# EAGLE board Test Machines (EAGLE 9.6.2)
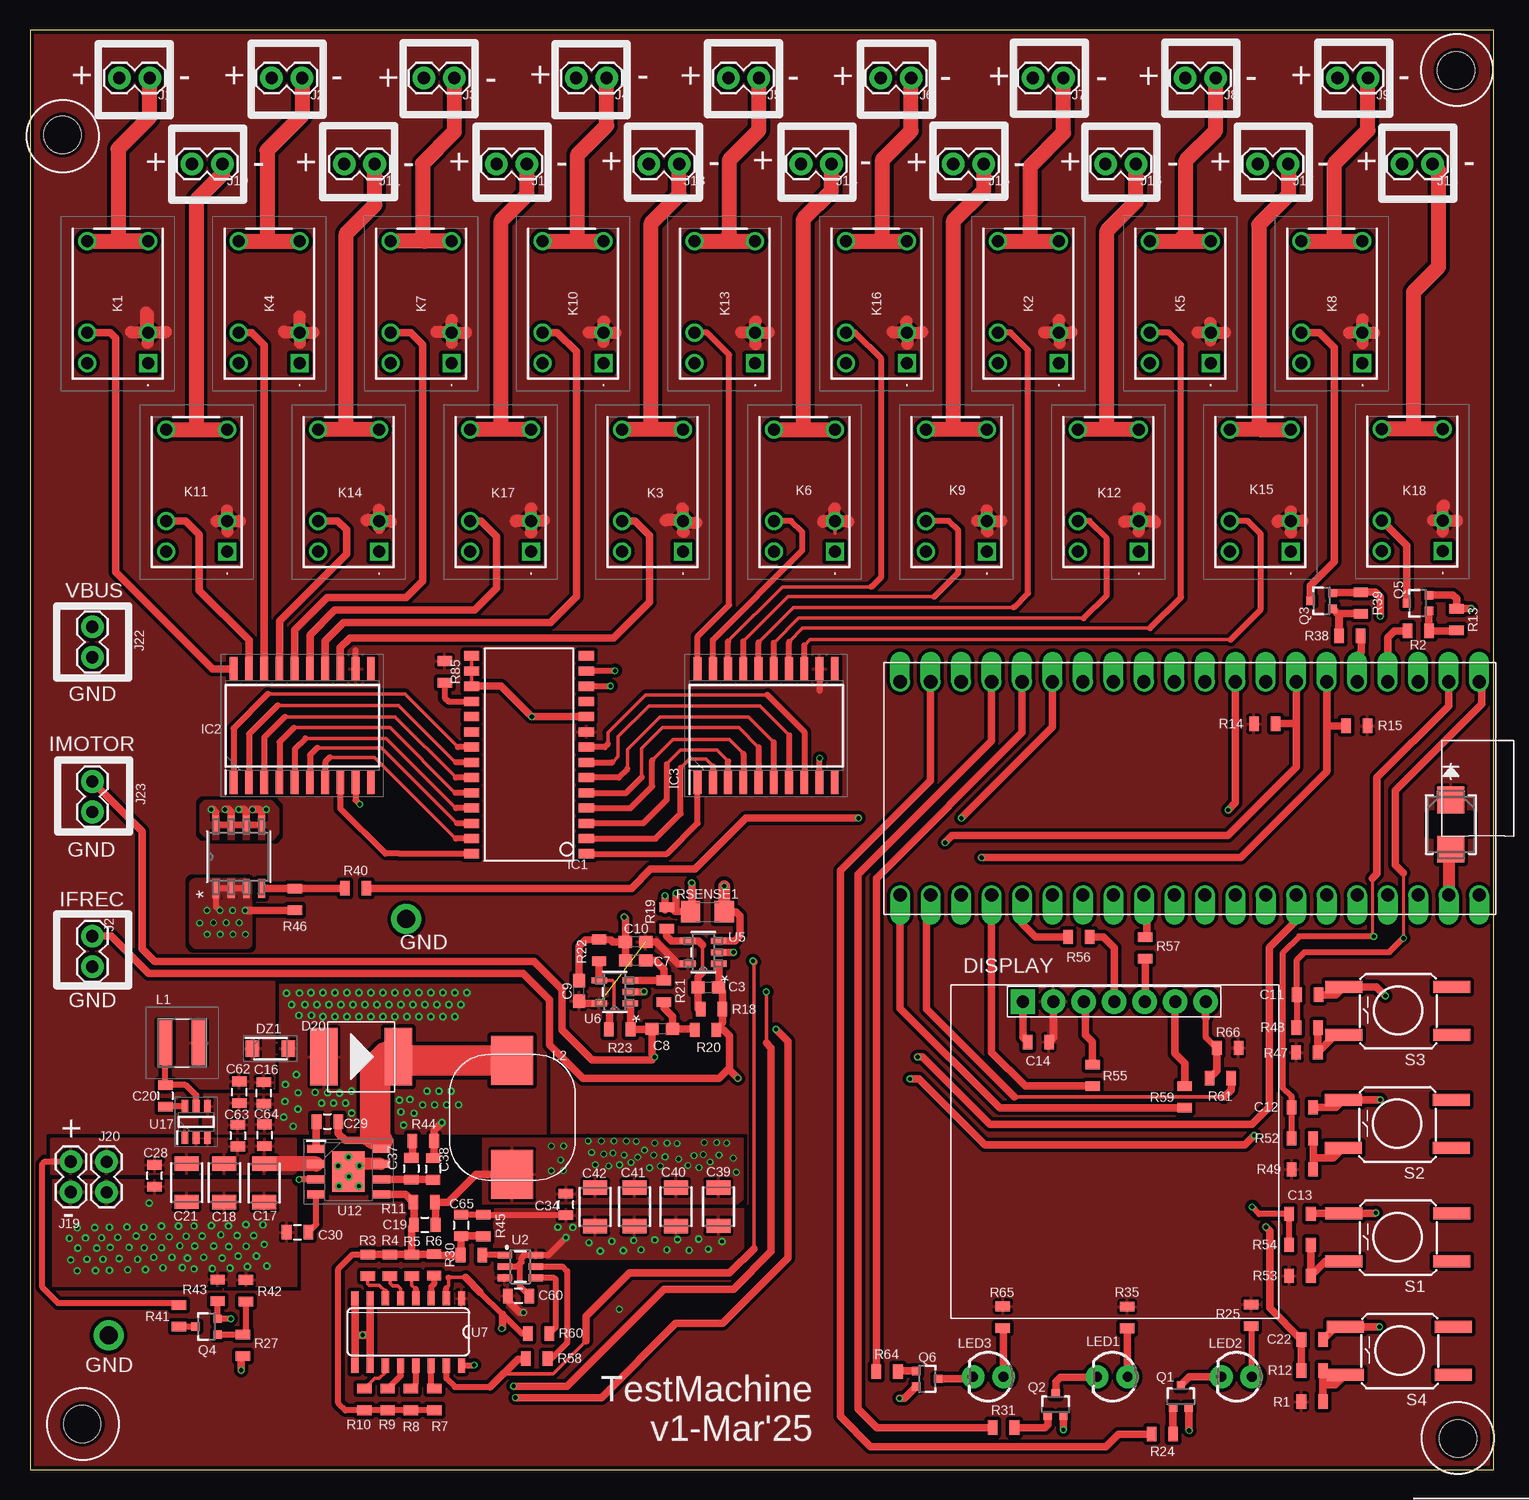
[diagram p3: board, top side]
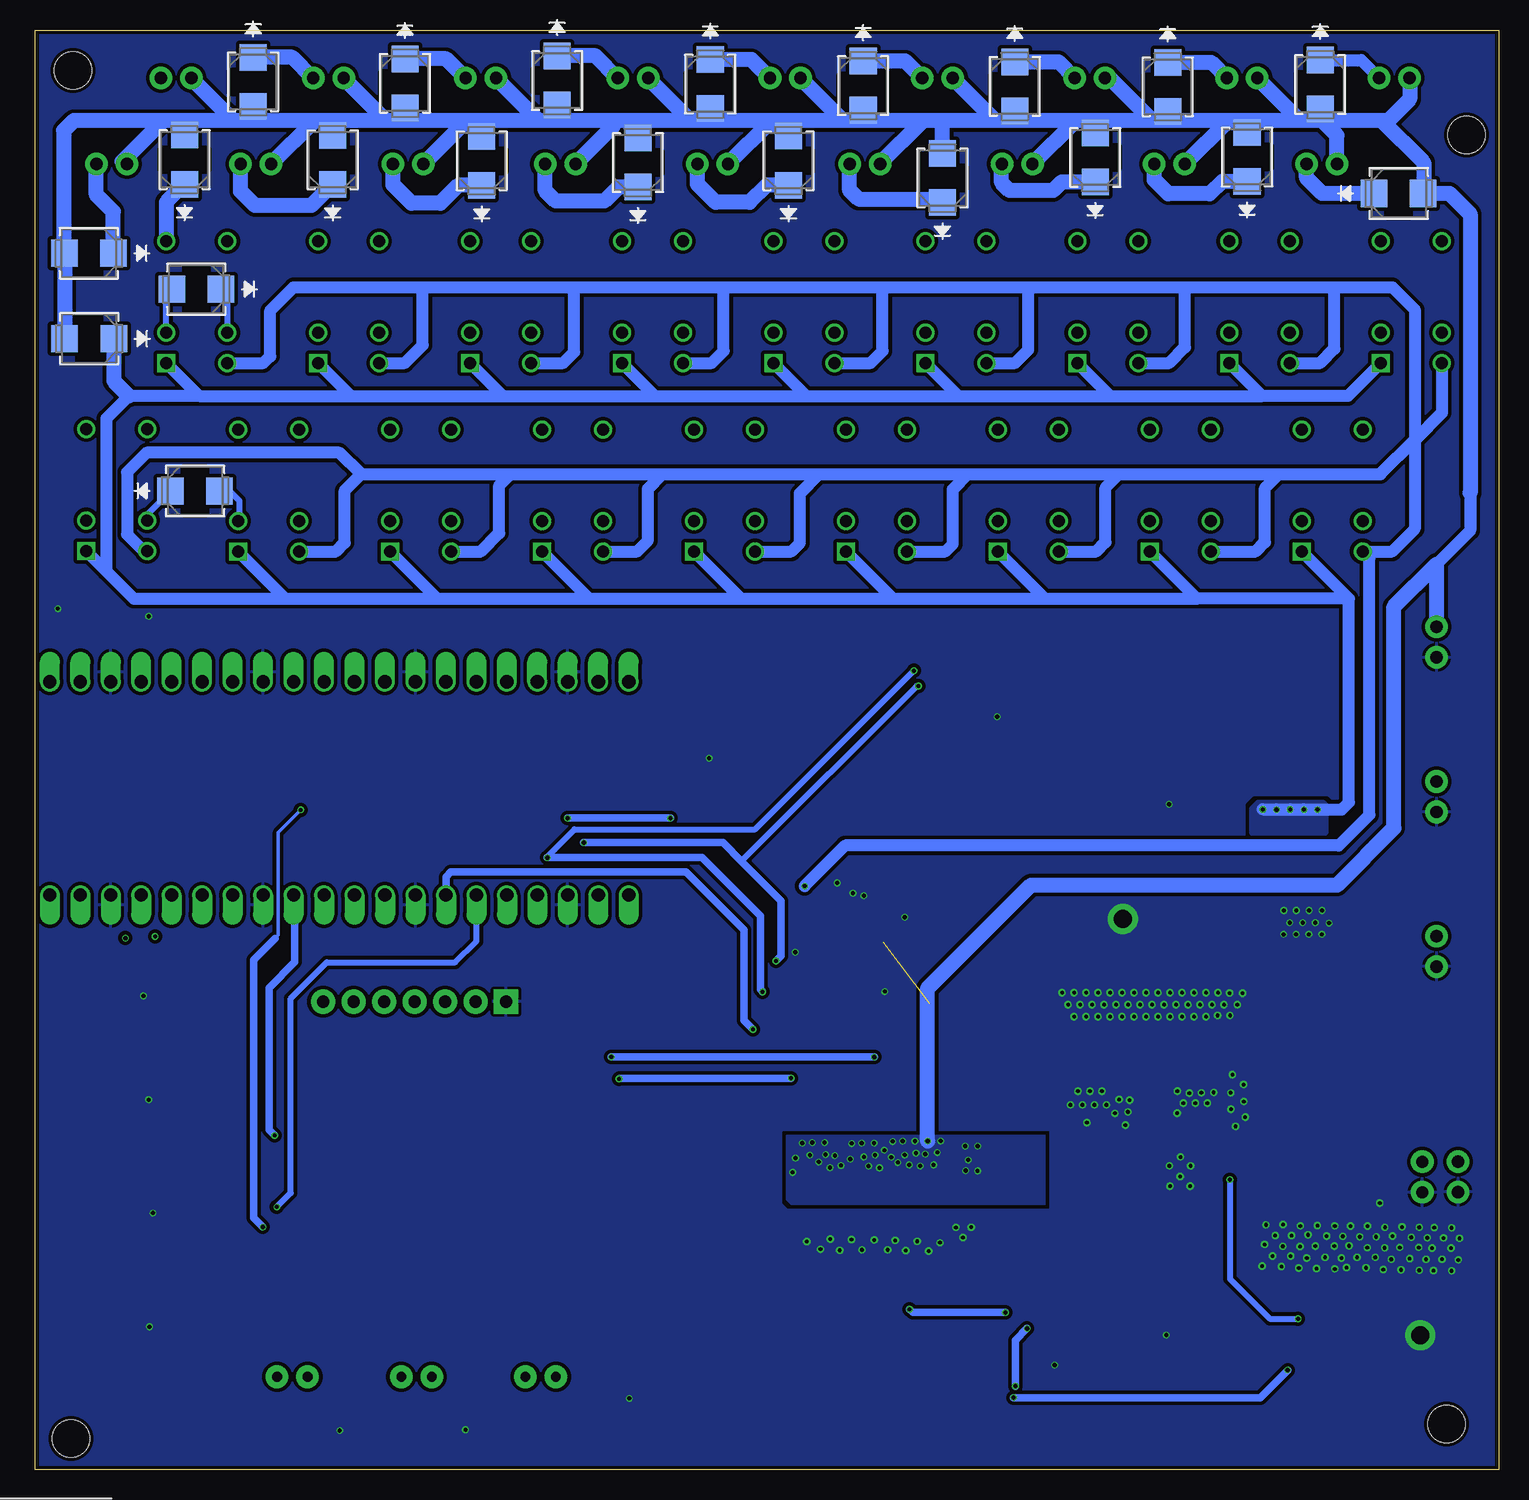
[diagram p4: board, bottom side, seen from below]

Size 122 x 120 mm. Coordinates in mm from the lower left corner, seen from the top.
Outline: 0,0 122,0 122,120 0,120 0,0
Copper layers (1*16): Top 0.035mm / dielectric 1.5mm / Bottom 0.035mm
Design rules "default *": minimum track width 8mil, minimum drill 12mil, track to track 12mil, track to pad 12mil, pad to pad 12mil, via to via 12mil, smd to smd 0mil, copper to edge 10mil, drill to drill 8mil, minimum pad ring 6mil, minimum via ring 4mil, stop-mask expansion 4mil, vias tented up to drill 25mil, thermal gap 10mil
Holes 3.1 mm at 119.03,2.58 4.36,3.79 2.71,111.26 118.87,116.64

## Footprints (pad centres in the part's own frame; a part is rotated, then mirrored left to right if it is on the bottom)
0603 = smd 1.1 x 1: 1 -0.85,0; 2 0.85,0
0603-NO = smd 1.1 x 1: 1 -0.85,0; 2 0.85,0
0805 = smd 0.8 x 1.2: 1 -0.9,0; 2 0.9,0
1210 = smd 1.2 x 2: 1 -1.6,0; 2 1.6,0
SMB_STM = smd 2.21 x 2.261: 1 -2.045,0; 2 2.045,0
DO-214AB = smd 2.286 x 4.8: 1 -3.1,0; 2 3.1,0
OLED_LCD = drill 1.016 pad 2.032 square: 1 -7.42,13.7 | drill 1.016 pad 2.032: 2 -4.88,13.7; 3 -2.34,13.7; 4 0.2,13.7; 5 2.74,13.7; 6 5.28,13.7; 7 7.82,13.7
SODFL3518X115N = smd 1.12 x 1.37: 1 -1.5,0; 2 1.5,0
SO28W = smd 0.762 x 1.27: 1 -7.62,-4.78; 2 -6.35,-4.78; 3 -5.08,-4.78; 4 -3.81,-4.78; 5 -2.54,-4.78; 6 -1.27,-4.78; 7 0,-4.78; 8 1.27,-4.78; 9 2.54,-4.78; 10 3.81,-4.78; 11 5.08,-4.78; 12 6.35,-4.78; 13 7.62,-4.78; 14 8.89,-4.78; 15 8.89,4.78; 16 7.62,4.78; 17 6.35,4.78; 18 5.08,4.78; 19 3.81,4.78; 20 2.54,4.78; 21 1.27,4.78; 22 0,4.78; 23 -1.27,4.78; 24 -2.54,4.78; 25 -3.81,4.78; 26 -5.08,4.78; 27 -6.35,4.78; 28 -7.62,4.78
SOIC127P1030X265-20N = smd 1.95 x 0.65: 1 -4.725,5.715; 2 -4.725,4.445; 3 -4.725,3.175; 4 -4.725,1.905; 5 -4.725,0.635; 6 -4.725,-0.635; 7 -4.725,-1.905; 8 -4.725,-3.175; 9 -4.725,-4.445; 10 -4.725,-5.715; 11 4.725,-5.715; 12 4.725,-4.445; 13 4.725,-3.175; 14 4.725,-1.905; 15 4.725,-0.635; 16 4.725,0.635; 17 4.725,1.905; 18 4.725,3.175; 19 4.725,4.445; 20 4.725,5.715
1X02 = drill 1.016 pad 1.88: 1 0,0; 2 2.54,0
J1031C3VDC15S = drill 1 pad 1.5 square: 1 0,0 | drill 1 pad 1.5: 2 2.54,0; 3 10.16,0; 4 10.16,5.08; 5 2.54,5.08; 6 0,5.08
NRS4018T100MDGJ = smd 1.2 x 3.7: 1 -1.4,0; 2 1.4,0
WE-LHMI = smd 4.1 x 3.5: 1 -4.75,0; 2 4.75,0
LED3MM = drill 0.813 pad 1.88: A -1.27,0; K 1.27,0
SOT323 = smd 0.7 x 0.7: 1 -0.65,-0.925; 2 0.65,-0.925; 3 0,0.925
1206 = smd 1.6 x 1.8: 1 -1.4,0; 2 1.4,0
TAC_SW_SMD_KSC931G = smd 3.1 x 1: 1 -4.5,2; 2 4.5,2; 3 -4.5,-2; 4 4.5,-2
SOT23-6 = smd 0.55 x 1.2: 1 0.95,1.3; 2 0,1.3; 3 -0.95,1.3; 4 -0.95,-1.3; 5 0,-1.3; 6 0.95,-1.3
SOT-23-5_MC_MCH = smd 1.31 x 0.508: 1 -1.295,0.95; 2 -1.295,0; 3 -1.295,-0.95; 4 1.295,-0.95; 5 1.295,0.95
SO16 = smd 0.6 x 1.2: 1 -4.445,-2.8; 2 -3.175,-2.8; 3 -1.905,-2.8; 4 -0.635,-2.8; 5 0.635,-2.8; 6 1.905,-2.8; 7 3.175,-2.8; 8 4.445,-2.8; 9 4.445,2.8; 10 3.175,2.8; 11 1.905,2.8; 12 0.635,2.8; 13 -0.635,2.8; 14 -1.905,2.8; 15 -3.175,2.8; 16 -4.445,2.8
RPI_PICO_TH = drill 1.1 pad 1.6 offset: 3V3 8.89,13.97; 3V3_EN 8.89,16.51; ADC_VREF 8.89,11.43; AGND 8.89,6.35; GND@1 -8.89,19.05; GND@2 -8.89,6.35; GND@3 -8.89,-6.35; GND@4 -8.89,-19.05; GND@6 8.89,-19.05; GND@7 8.89,-6.35; GND@8 8.89,19.05; GP0 -8.89,24.13; GP1 -8.89,21.59; GP2 -8.89,16.51; GP3 -8.89,13.97; GP4 -8.89,11.43; GP5 -8.89,8.89; GP6 -8.89,3.81; GP7 -8.89,1.27; GP8 -8.89,-1.27; GP9 -8.89,-3.81; GP10 -8.89,-8.89; GP11 -8.89,-11.43; GP12 -8.89,-13.97; GP13 -8.89,-16.51; GP14 -8.89,-21.59; GP15 -8.89,-24.13; GP16 8.89,-24.13; GP17 8.89,-21.59; GP18 8.89,-16.51; GP19 8.89,-13.97; GP20 8.89,-11.43; GP21 8.89,-8.89; GP22 8.89,-3.81; GP26_A0 8.89,1.27; GP27_A1 8.89,3.81; GP28_A2 8.89,8.89; RUN 8.89,-1.27; VBUS 8.89,24.13; VSYS 8.89,21.59
SOIC127P600X163-9N = smd 1.5 x 0.65: 1 -2.7,1.905; 2 -2.7,0.635; 3 -2.7,-0.635; 4 -2.7,-1.905; 5 2.7,-1.905; 6 2.7,-0.635; 7 2.7,0.635; 8 2.7,1.905 | smd 2.71 x 3.35: 9 0,0
SOIC8_4X5_ONS = smd 1.6 x 0.559: 1 -2.654,1.905; 2 -2.654,0.635; 3 -2.654,-0.635; 4 -2.654,-1.905; 5 2.654,-1.905; 6 2.654,-0.635; 7 2.654,0.635; 8 2.654,1.905
SOT95P280X100-6N = smd 1.05 x 0.55: 1 -1.3,0.95; 2 -1.3,0; 3 -1.3,-0.95; 4 1.3,-0.95; 5 1.3,0; 6 1.3,0.95

## Placement (x,y rotation side)
C3  100n  [0603]  56.54,40.18 180 top
C7  1u  [0603-NO]  50.49,42.44 180 top
C8  1u  [0603-NO]  52.7,36.74 180 top
C9  100n  [0603]  45.77,39.89 90 top
C10  100n  [0603]  50.48,43.99 180 top
C11  100n  [0805]  106.5,39.57 180 top
C12  100n  [0805]  106.07,30.19 180 top
C13  100n  [0805]  105.87,21.31 180 top
C14  100n  [0805]  84.05,35.63 180 top
C16  22uF 10V X5R  [0805]  19.48,31.39 90 top
C17  4.7uF 50V X7R  [1210]  19.52,23.88 270 top
C18  4.7uF 50V X7R  [1210]  16.2,23.9 270 top
C19  N.C.  [0805]  32.91,20.39 0 top
C20  100n 50v X7R/X5R  [0805]  11.29,31.15 270 top
C21  4.7uF 50V X7R  [1210]  13.05,23.91 270 top
C22  100n  [0805]  106.88,10.83 180 top
C28  100n 50v X7R/X5R  [0805]  10.38,24.5 90 top
C29  100n 50v X7R/X5R  [0805]  24.8,29 0 top
C30  33n  [0805]  22.29,19.78 0 top
C34  100n 50v X7R/X5R  [0805]  44.67,22.09 90 top
C37  10nF  [0805]  31.78,25.08 270 top
C38  16pF  [0805]  33.6,25.05 270 top
C39  22uF 25V X5R  [1210]  57.4,21.91 270 top
C40  22uF 25V X5R  [1210]  53.85,21.91 270 top
C41  22uF 25V X5R  [1210]  50.4,21.9 270 top
C42  22uF 25V X5R  [1210]  47.11,21.9 270 top
C60  100n 50v X7R/X5R  [0805]  40.73,14.46 180 top
C62  22uF 10V X5R  [0805]  17.45,31.45 90 top
C63  4.7uF 50V X5R  [0805]  17.32,27.84 270 top
C64  4.7uF 50V X5R  [0805]  19.55,27.87 270 top
C65  N.C.  [0805]  35.94,20.36 270 top
D1  STPS1L40U  [SMB_STM]  14.89,115.45 270 bottom
D2  STPS1L40U  [SMB_STM]  27.61,115.25 270 bottom
D3  STPS1L40U  [SMB_STM]  40.36,115.29 270 bottom
D4  STPS1L40U  [SMB_STM]  53,115.36 270 bottom
D5  STPS1L40U  [SMB_STM]  65.74,115.49 270 bottom
D6  STPS1L40U  [SMB_STM]  78.51,115.79 270 bottom
D7  STPS1L40U  [SMB_STM]  91.19,115.54 270 bottom
D8  STPS1L40U  [SMB_STM]  103.85,115.67 270 bottom
D9  STPS1L40U  [SMB_STM]  109.56,109.19 90 bottom
D10  STPS1L40U  [SMB_STM]  8.36,106.37 0 bottom
D11  STPS1L40U  [SMB_STM]  20.99,109.41 90 bottom
D12  STPS1L40U  [SMB_STM]  33.65,109.37 90 bottom
D13  STPS1L40U  [SMB_STM]  46.38,107.66 90 bottom
D14  STPS1L40U  [SMB_STM]  59.22,109.1 90 bottom
D15  STPS1L40U  [SMB_STM]  71.77,108.95 90 bottom
D16  STPS1L40U  [SMB_STM]  84.79,109.09 90 bottom
D17  STPS1L40U  [SMB_STM]  97.22,109.18 90 bottom
D18  STPS1L40U  [SMB_STM]  117.54,101.39 180 bottom
D19  STPS1L40U  [SMB_STM]  117.51,94.27 180 bottom
D20  N.C  [DO-214AB]  27.6,34.41 0 top
D21  STPS1L40U  [SMB_STM]  118.45,53.77 270 top
D22  STPS1L40U  [SMB_STM]  108.69,81.58 0 bottom
D23  STPS1L40U  [SMB_STM]  108.58,98.39 180 bottom
DISPLAY  Display  [OLED_LCD]  90.19,25.3 0 top
DZ1  MMSZ5228B-7-F  [SODFL3518X115N]  20.03,35.1 0 top
IC1  MCP23017SO  [SO28W]  41.6,58.95 90 top
IC2  ULN2803CDWR  [SOIC127P1030X265-20N]  22.7,62.01 90 top
IC3  ULN2803CDWR  [SOIC127P1030X265-20N]  61.37,62.01 90 top
J1  [1X02]  9.99,115.99 180 top
J2  [1X02]  22.68,115.99 180 top
J3  [1X02]  35.37,115.99 180 top
J4  [1X02]  48.07,115.99 180 top
J5  [1X02]  60.76,115.99 180 top
J6  [1X02]  73.45,115.99 180 top
J7  [1X02]  86.15,115.99 180 top
J8  [1X02]  98.84,115.99 180 top
J9  [1X02]  111.53,115.99 180 top
J10  [1X02]  16.04,108.84 180 top
J11  [1X02]  28.73,108.84 180 top
J12  [1X02]  41.42,108.84 180 top
J13  [1X02]  54.12,108.84 180 top
J14  [1X02]  66.81,108.84 180 top
J15  [1X02]  79.5,108.84 180 top
J16  [1X02]  92.2,108.84 180 top
J17  [1X02]  104.89,108.84 180 top
J18  [1X02]  116.91,108.84 180 top
J19  [1X02]  3.41,25.67 270 top
J20  [1X02]  6.39,25.65 270 top
J22  [1X02]  5.2,70.25 270 top
J23  [1X02]  5.2,57.35 270 top
J24  [1X02]  5.2,44.46 270 top
K1  J1031C3VDC.15S  [J1031C3VDC15S]  9.84,92.24 90 top
K2  J1031C3VDC.15S  [J1031C3VDC15S]  85.77,92.24 90 top
K3  J1031C3VDC.15S  [J1031C3VDC15S]  54.43,76.53 90 top
K4  J1031C3VDC.15S  [J1031C3VDC15S]  22.49,92.24 90 top
K5  J1031C3VDC.15S  [J1031C3VDC15S]  98.42,92.24 90 top
K6  J1031C3VDC.15S  [J1031C3VDC15S]  67.1,76.53 90 top
K7  J1031C3VDC.15S  [J1031C3VDC15S]  35.15,92.24 90 top
K8  J1031C3VDC.15S  [J1031C3VDC15S]  111.08,92.24 90 top
K9  J1031C3VDC.15S  [J1031C3VDC15S]  79.77,76.53 90 top
K10  J1031C3VDC.15S  [J1031C3VDC15S]  47.8,92.24 90 top
K11  J1031C3VDC.15S  [J1031C3VDC15S]  16.44,76.53 90 top
K12  J1031C3VDC.15S  [J1031C3VDC15S]  92.43,76.53 90 top
K13  J1031C3VDC.15S  [J1031C3VDC15S]  60.46,92.24 90 top
K14  J1031C3VDC.15S  [J1031C3VDC15S]  29.1,76.53 90 top
K15  J1031C3VDC.15S  [J1031C3VDC15S]  105.1,76.53 90 top
K16  J1031C3VDC.15S  [J1031C3VDC15S]  73.11,92.24 90 top
K17  J1031C3VDC.15S  [J1031C3VDC15S]  41.77,76.53 90 top
K18  J1031C3VDC.15S  [J1031C3VDC15S]  117.76,76.57 90 top
L1  NRS4018T4R7MDGJ  [NRS4018T100MDGJ]  12.67,35.58 0 top
L2  4.7uH  [WE-LHMI]  40.21,29.36 270 top
LED1  [LED3MM]  90.23,7.73 180 top
LED2  [LED3MM]  100.58,7.73 180 top
LED3  [LED3MM]  79.88,7.73 180 top
Q1  2N7002PW  [SOT323]  95.94,6.08 0 top
Q2  2N7002PW  [SOT323]  85.49,5.42 0 top
Q3  2N7002PW  [SOT323]  107.67,72.41 90 top
Q4  2N7002PW  [SOT323]  14.72,11.92 90 top
Q5  2N7002PW  [SOT323]  115.69,72.22 90 top
Q6  2N7002PW  [SOT323]  74.8,7.56 270 top
R1  [0805]  106.88,5.66 180 top
R2  100R  [0805]  115.72,69.91 180 top
R3  11k  [0805]  28.15,17.02 90 top
R4  5k6  [0805]  30,17.02 90 top
R5  2k8  [0805]  31.83,17.02 90 top
R6  1k4  [0805]  33.69,17.05 90 top
R7  180k  [0805]  33.7,5.84 270 top
R8  91k  [0805]  31.75,5.84 270 top
R9  43k  [0805]  29.81,5.84 270 top
R10  22k  [0805]  27.87,5.84 270 top
R11  15k  [0805]  32.85,22.29 0 top
R12  [0805]  106.88,8.25 0 top
R13  10K  [0805]  118.92,70.85 270 top
R14  10K  [0805]  102.94,62.16 0 top
R15  10K  [0805]  110.6,62 180 top
R18  5k1  [0805]  56.81,38.38 180 top
R19  8k2  [0805]  53.07,45.97 90 top
R20  2k4  [0805]  56.32,36.65 0 top
R21  62k  [0805]  52.84,39.87 270 top
R22  4k3  [0805]  47.44,43.28 90 top
R23  36k  [0805]  49.16,36.69 180 top
R24  [0805]  94.39,2.95 0 top
R25  [0805]  101.8,12.85 270 top
R27  1k  [0805]  17.74,10.34 270 top
R30  N.C  [0805]  36.8,17.87 180 top
R31  [0805]  81.16,3.49 0 top
R35  [0805]  91.46,12.67 270 top
R38  100R  [0805]  110.03,69.51 0 top
R39  10K  [0805]  110.94,72.24 270 top
R40  100R  [0805]  27.15,48.45 0 top
R41  150k  [0805]  12.41,12.82 90 top
R42  10k  [0805]  18,14.91 270 top
R43  11k  [0805]  15.65,14.95 270 top
R44  25k  [0805]  32.79,27.4 180 top
R45  N.C  [0805]  37.81,20.34 270 top
R46  10K  [0805]  22.09,47.51 90 top
R47  [0805]  106.46,34.77 180 top
R48  [0805]  106.46,36.84 0 top
R49  [0805]  106.07,25.02 180 top
R52  [0805]  106.07,27.61 0 top
R53  [0805]  105.87,16.15 180 top
R54  [0805]  105.87,18.73 0 top
R55  33  [0805]  88.57,32.86 90 top
R56  33  [0805]  87.44,44.39 0 top
R57  33  [0805]  92.97,43.49 270 top
R58  [0805]  42.24,9.24 0 top
R59  33  [0805]  96.27,31.06 90 top
R60  [0805]  42.4,11.33 0 top
R61  33  [0805]  99.23,32.61 180 top
R64  [0805]  71.45,8.18 0 top
R65  [0805]  81.09,12.7 270 top
R66  10k  [0805]  99.84,35.14 180 top
R85  [0805]  34.57,66.5 270 top
RSENSE1  100mR  [1206]  56.47,46.48 0 top
S1  [TAC_SW_SMD_KSC931G]  114.01,19.35 180 top
S2  [TAC_SW_SMD_KSC931G]  113.97,28.8 180 top
S3  [TAC_SW_SMD_KSC931G]  114.03,38.24 180 top
S4  [TAC_SW_SMD_KSC931G]  114.15,9.9 180 top
U2  MCP4725  [SOT23-6]  40.87,16.93 90 top
U5  MCP6071T-E/OT  [SOT-23-5_MC_MCH]  56.13,43.12 180 top
U6  MCP6071T-E/OT  [SOT-23-5_MC_MCH]  48.75,39.82 180 top
U7  TPIC2810D  [SO16]  31.53,11.47 180 top
U8  [RPI_PICO_TH]  96.67,56.77 270 top
U12  AP64501SP-13  [SOIC127P600X163-9N]  26.56,24.83 0 top
U15  NTMS4801NR2G  [SOIC8_4X5_ONS]  17.4,51.08 90 top
U17  AP63203  [SOT95P280X100-6N]  13.85,28.97 90 top

## Tracks (layer width: path | path; a pad name or v marks a point on that pad's centre or on a via)
CS
  Top 0.508: 97.99,37.67 97.99,36.04 98.89,35.14
  Top 0.61: R61.2 98.94,33.21 R66.2 98.89,35.14 | DISPLAY.7 97.99,38.98 97.99,37.67 98.06,37.67
D0
  Top 0.61: R55.2 88.57,35.64 87.97,36.24 87.97,38.88 DISPLAY.3
D1
  Top 0.61: R56.2 89.47,44.4 90.39,43.48 DISPLAY.4
DSP_RST
  Top 0.61: R57.1 93.09,44.51 93.09,47.65 U8.GP22
EN_DCDC  (via drill 0.35)
  Top 0.61: v62.18,36.68 63.19,35.67 63.19,17.63 57.74,12.17 53.83,12.17 47.64,5.98 40.48,5.98 v40.46,5.99 | v17.61,8.28 17.61,9.31 R27.2
  Bottom 0.61: U8.GP21 87.78,49.38 87.37,49.8 67.74,49.8 62.94,44.99 62.94,37.44 v62.18,36.68 | v40.46,5.99 19.9,5.99 v17.61,8.28
EN_TPS54531  (via drill 0.35)
  Top 0.508: U12.3 22.46,24.2 v22.43,24.17 | v16.75,12.56 Q4.2 R43.2
  Bottom 0.508: v22.43,24.17 22.43,15.89 19.1,12.56 v16.75,12.56
FB_DAC
  Top 0.508: U2.1 R30.1
GND  (via drill 0.3 pad 0.6, 0.35, 1.5 pad 2.5)
  Top 0.305: IC1.15 IC1.16 IC1.17
  Top 0.508: U7.16 37,8.67 v37.03,8.71 | U2.2 40.6,16.93 40.83,17.16 | 40.83,17.16 40.99,17.31 40.99,17.63 41.23,17.88 U2.6 43.22,17.88 v44.68,19.33 | C60.1 40.83,15.25 40.83,17.16 | C65.1 37.78,21.26 R45.1 44.62,21.24 C34.1 | IC2.9 27.14,55.81 v27.49,55.46 | IC3.9 65.82,59.27 v65.84,59.29 | U15.3 U15.2 U15.1 15.5,46.93 v15.83,46.6
  Top 0.61: Q2.2 v86.15,3.32 | C9.2 45.77,43.59 46.31,44.13 R22.2 48.42,44.13 48.57,43.98 49.62,43.98 C10.2 49.63,42.45 C7.2 49.64,45.94 v49.54,46.04 | 54.15,46.51 55.04,46.51 RSENSE1.1 54.8,46.76 55.2,46.76 55.2,48.85 v55.16,48.89 | 54.15,46.51 53.78,46.51 53.84,46.58 v53.84,48.04 | 54.15,46.51 R19.2 52.94,46.63 v52.94,47.83 | Q6.2 72.89,5.93 v72.49,5.93 | C38.1 33.69,26.04 R44.1 33.69,28.26 v34.35,28.92 | C14.2 82.77,36.01 DISPLAY.1 | U7.10 28.36,11.2 | U7.7 28.36,11.2 | U7.9 27.09,11.41 | 27.09,11.41 U7.8 | 28.36,11.2 27.3,11.2 27.09,11.41 | 28.36,11.2 28.34,11.21 v27.73,11.21 | U5.2 v58.65,43.12 | U6.2 51.17,39.82 v51.19,39.84 | U12.9 26.58,24.81 v26.58,24.41 | Q1.2 96.59,3.29 v96.63,3.25 | IC1.17 39.29,65.3 v41.83,62.76 IC1.10 | R46.1 v17.94,46.61 v17.93,46.6 | Q5.2 116.65,72.9 118.61,72.9 118.92,72.59 R13.1 118.94,71.76 v120.13,71.76 | Q3.2 108.61,73.08 110.88,73.08 R39.1 112.16,73.14 112.55,72.74 v112.55,71.13 | C11.1 108.86,39.58 S3.4 112.23,40.24 v113,39.48 | C12.1 108.86,30.19 S2.4 112.53,30.8 v112.56,30.82 | C22.1 108.86,11.9 S4.4 v112.49,11.9 v112.5,11.9 | C13.1 106.81,21.35 S1.4 112.16,21.35 v112.2,21.39
  Top 1.016: U12.7 27.19,25.47
  Top 1.27: 27.19,25.47 U12.9
  other vias: 30.79,30.79 26.82,29.71 30.93,29.81 22.42,37.85 23.42,39.75 21.15,29.37 22.92,38.75 24.42,39.75 25.42,39.75 23.92,38.75 24.92,38.75 26.42,39.75 27.42,39.75 25.92,38.75 26.92,38.75 28.42,39.75 29.42,39.75 27.92,38.75 28.92,38.75 30.42,39.75 31.42,39.75 29.92,38.75 30.92,38.75 32.42,39.75 33.42,39.75 31.92,38.75 32.92,38.75 34.42,39.75 35.42,39.75 33.92,38.75 34.92,38.75 36.42,39.75 35.92,38.75 35.42,37.75 34.42,37.75 33.42,37.75 32.42,37.75 31.42,37.75 30.42,37.75 29.42,37.75 28.42,37.75 27.42,37.75 26.42,37.75 25.42,37.75 24.42,37.75 23.45,37.85 22.45,39.72 31.14,28.71 33.1,31.55 32.73,30.39 34.1,31.55 35.1,31.55 21.81,38.74 33.73,30.39 47.54,18.21 34.73,30.39 32.01,29.7 35.73,30.39 49.45,18.26 46.59,18.91 21.26,30.68 53.97,19.16 56.55,18.36 53.1,18.31 50.94,18.31 52.08,19.14 23.77,31.44 24.31,30.53 25.31,30.53 24.81,31.41 25.81,31.37 26.31,30.53 26.81,31.53 22.34,30.05 55.74,19.21 45.26,20.18 31.67,30.84 22.35,31.41 54.95,18.27 57.69,19 50.32,19.09 44,20.2 21.94,28.61 21.28,32.09 21.37,39.72 22.21,32.92 48.5,19.02 14.36,19.46 13.68,20.3 13.02,19.43 15.13,20.33 16.55,20.3 13.73,18.62 15.31,18.62 19.42,20.4 16.57,18.59 16.68,16.79 14.48,17.69 15.19,16.75 13.68,16.72 9.93,22.21 18.87,17.79 17.27,19.5 19.74,16.96 18.13,16.92 19.53,18.76 18.02,18.6 17.35,17.79 16.02,17.63 18,20.41 15.9,19.57 18.64,19.5 13.13,17.63 27.42,23.63 25.74,23.63 27.47,25.31 25.69,25.31 26.55,26.05 7.31,19.35 6.63,20.19 5.97,19.32 8.08,20.22 9.5,20.19 6.68,18.51 8.26,18.51 12.37,20.29 9.52,18.48 9.63,16.67 7.44,17.58 8.15,16.64 6.63,16.61 11.83,17.68 10.23,19.39 12.7,16.84 11.08,16.81 12.49,18.65 10.97,18.49 10.31,17.68 8.97,17.52 10.95,20.29 8.86,19.46 11.6,19.39 6.08,17.52 4.62,19.3 3.94,20.14 3.28,19.27 5.39,20.17 3.99,18.46 5.57,18.46 4.75,17.53 5.46,16.59 3.94,16.56 3.39,17.47 6.54,11.17 31.37,45.88 14.74,46.6 14.15,45.55 14.77,44.61 15.3,45.59 16.35,45.59 16.88,46.6 17.44,45.59 17.95,44.61 16.91,44.61 15.85,44.61
  pour Top (isolate 0.305): 20.78,40.42 20.78,27.99 43.05,27.99 43.05,40.42
  pour Top: 38.69,21.74 59.44,21.74 59.44,17.52 38.69,17.52
  pour Top: 1.92,24.15 22.19,24.15 22.19,15.26 1.92,15.26
  pour Top: 14.45,31.32 21.74,31.32 21.74,28 14.45,28
  pour Bottom (isolate 0.305, rank 3): -4.71,123.14 125.84,123.14 125.84,-2.54 -4.71,-2.54
  pour Top: 13.73,48.79 13.73,44.04 13.89,43.89 18.05,43.89 18.05,48.71 17.96,48.79
GND_MOTOR  (via drill 0.35)
  Top 0.508: U15.5 U15.6 U15.7 U15.8
  Top 0.61: U15.8 15.47,53.76 15.47,54.79 15.26,55.01 v15.11,55.01 | U15.7 16.77,54.82 16.58,55.01 v16.25,55.01 | U15.6 18.04,54.83 17.84,55.02 v17.4,55.02 | v18.54,55.01 19.09,55.01 19.31,54.78 U15.5
  Bottom 1.016: v19.68,55.02 18.56,55.02 v18.54,55.01 17.41,55.01 v17.4,55.02 16.26,55.02 v16.25,55.01 v15.11,55.01 13.11,55.01 12.51,55.61 12.51,72.6 | 12.51,72.6 K11.1 | 12.51,72.6 25.17,72.6 | 25.17,72.6 K14.1 | K17.1 37.84,72.6 | 37.84,72.6 25.17,72.6 | K3.1 50.51,72.6 | 50.51,72.6 37.84,72.6 | K6.1 63.17,72.6 | 63.17,72.6 50.51,72.6 | K9.1 75.84,72.6 | 75.84,72.6 63.17,72.6 | K12.1 88.5,72.6 | 88.5,72.6 75.84,72.6 | K18.1 116.08,74.89 | 116.08,74.89 113.79,72.6 101.17,72.6 | 101.17,72.6 88.5,72.6 | K15.1 101.17,72.6 | K1.1 12.59,89.48 19.74,89.48 | 19.74,89.48 K4.1 | K7.1 32.39,89.48 | 32.39,89.48 19.74,89.48 | K10.1 45.05,89.48 | 45.05,89.48 32.39,89.48 | K13.1 57.7,89.48 | 57.7,89.48 45.05,89.48 | K16.1 70.36,89.48 | 70.36,89.48 57.7,89.48 | K2.1 83.02,89.48 | 83.02,89.48 70.36,89.48 | K5.1 95.67,89.48 | 95.67,89.48 83.02,89.48 | K8.1 108.33,89.48 | 108.33,89.48 95.67,89.48 | 108.33,89.48 114.22,89.48 116.08,87.62 116.08,74.89
  Bottom 1.27: D19.1 115.47,90.74 114.22,89.48
  pour Top: 14.45,53.22 14.88,52.78 20.17,52.78 20.5,53.1 20.5,55.03 20.01,55.51 14.63,55.51 14.45,55.33
  pour Bottom: 14.51,53.13 14.85,52.78 20.19,52.78 20.5,53.08 20.5,55.06 20.05,55.51 14.67,55.51 14.51,55.35
I_FREC  (via drill 0.35)
  Top 0.61: U5.1 57.42,40.21 C3.1 57.71,39.85 R18.1 57.71,37.26 R20.2 57.82,36.65 58.3,36.16 58.3,33.47 58.24,33.41 | J24.1 6.79,44.46 9.91,41.34 41.09,41.34 43.3,39.13 43.3,35.39 46.09,32.59 57.43,32.59 58.24,33.41 | 58.24,33.41 58.87,32.78 58.84,32.78 v59,32.62 | v73.34,32.56 74.12,32.56 79.62,27.06 101.27,27.06 v102.06,27.84
  Bottom 0.61: v102.06,27.84 102.53,28.32 102.53,40.16 100.39,42.31 100.39,47.79 U8.GP27_A1 | v73.34,32.56 73.29,32.62 v59.01,32.62 v59,32.62
IMOTOR  (via drill 0.35)
  Top 0.61: U6.1 50.05,36.73 R23.1 51.81,36.69 C8.2 51.85,34.6 v52.07,34.38 51.84,34.15 46.84,34.15 44.35,36.64 44.35,40.02 42.03,42.35 10.41,42.35 9.36,43.4 9.36,53.19 J23.1 | v73.99,34.38 74.4,34.38 80.03,28.76 101.84,28.76 103.3,30.21 103.3,43.53 105.56,45.79 U8.GP28_A2
  Bottom 0.61: v73.99,34.38 v52.07,34.38
LED1
  Top 0.61: U8.GP12 82.7,61.42 70.55,49.28 R64.1
LED2
  Top 0.61: R31.1 70.59,3.48 69.03,5.04 69.03,49.61 80.16,60.74 U8.GP13
LED3
  Top 0.61: R24.1 90.73,2.94 89.69,1.91 70.07,1.91 67.56,4.42 67.56,49.92 75.07,57.42 75.07,65.65 U8.GP14
MISO
  Top 0.61: U8.GP16 72.54,38.43 80.84,30.13 96.23,30.13 R59.1
MOSI
  Top 0.61: U8.GP19 82.7,45.5 83.81,44.39 R56.1
N$1
  Top 0.305: R3.1 28.15,15.49 28.27,15.37 29.09,15.37 29.63,14.84
  Top 0.508: 29.63,14.84 U7.6
N$2
  Top 0.305: R4.1 30,15.52 30.21,15.3 30.66,15.3 30.9,15.07 U7.5
N$3
  Top 0.305: R5.1 31.83,15.36 32.17,15.03
  Top 0.508: U7.4 32.17,15.03
N$4
  Top 0.508: R6.1 33.69,15.49 33.44,15.24 U7.3
N$5
  Top 0.508: R7.1 33.44,6.99 U7.14
N$7
  Top 0.508: R8.1 32.17,7.15 U7.13
N$8
  Top 0.508: R9.1 30.9,7.82 U7.12
N$9
  Top 0.305: R10.1 28.73,7.59 29.12,7.59 29.63,8.11 U7.11
N$10
  Top 0.508: 107.78,7.08 R1.1
  Top 0.61: R12.2 107.78,7.08 | 107.78,7.08 R1.1 | S4.2 108.83,7.08 107.78,7.08
N$11
  Top 0.61: R35.2 91.5,11.74 LED1.A
N$12
  Top 0.61: LED1.K 88.94,7.71 85.91,7.71 85.5,7.3 85.5,6.35 Q2.3
N$13
  Top 0.61: R13.2 118.88,69.91 R2.1 Q5.1
N$14
  Top 0.61: Q5.3 114.77,77.03 K18.5
  Bottom 0.508: D22.1 112.68,79.62 K18.5
N$15
  Top 0.61: K8.5 107.48,94.78 108.75,93.51 108.75,75.68 106.74,73.68 Q3.3
  Bottom 0.508: D23.1 106,97.85 K8.5
N$17
  Top 0.305: 56.05,41.43 56.05,43.74
  Top 0.61: R19.1 53.07,44.47 53.48,44.07 U5.4 55.73,44.07 56.05,43.74 | 56.05,41.43 55.69,41.06 C3.2 55.71,40.16 55.71,38.39 55.71,38.38 R18.2
N$18
  Top 0.305: U6.4 48.58,40.77 48.69,40.66 48.69,38.34 48.31,37.96
  Top 0.61: U6.4 47.46,42.42 R22.1 | 48.31,37.96 R23.2
N$19
  Top 0.508: R7.2 R8.2 R9.2 R10.2 26.3,4.94 25.71,5.53 25.71,16.75 26.88,17.92 R3.2
  Top 0.61: U12.5 31.32,22.93 R11.1 32.01,22.23 C19.1 31.83,20.21 R5.2 | R45.2 37.78,19.46 C65.2 35.94,17.91 R30.2 33.77,17.87 R6.2 33.66,17.92 R5.2 | R5.2 R4.2 | R4.2 | R4.2 R3.2
N$20
  Top 0.61: R21.2 52.84,38.48 53.55,37.76 C8.1 53.56,36.72 55.34,36.72 R20.1
N$21
  Top 0.61: Q2.1 84.84,3.73 84.61,3.49 R31.2
N$22
  Top 0.61: U6.3 52.79,40.77 R21.1 52.84,41.69 52.09,42.44 C7.1
N$24
  Top 0.61: Q1.1 R24.2
N$25
  Top 0.508: LED2.A 101.85,11.91 R25.2
N$26
  Top 0.61: Q1.3 96.66,7.73 LED2.K
N$31
  Top 0.61: R39.2 110.9,71.37 109.13,71.37 R38.1 109.12,69.52 109.12,71.24 Q3.1
N$34
  Top 0.61: R46.2 22.11,48.42 | R40.1 26.23,48.42 22.11,48.42 | 22.11,48.42 22.1,48.43 U15.4
N$35
  Top 0.508: Q4.3 R41.1
N$38
  Top 0.61: S3.2 108.83,36.24 R47.1 R48.2
N$39
  Top 0.508: R49.1 106.97,25.98 R52.2
  Top 0.61: S2.2 108.65,25.98 106.97,25.98 | R52.2 R49.1
N$41
  Top 0.61: R54.2 R53.1 107.97,17.35 S1.2
N$43
  Top 0.61: DISPLAY.6 95.44,38.97 95.44,34.69 96.27,33.86 R59.2
N$44
  Top 0.508: C30.2 23.86,20.44 U12.4
N$45
  Top 0.508: U2.5 44.38,16.93 44.78,16.53 44.78,10.58 43.44,9.24 R58.2
N$47
  Top 0.61: U12.1 23.86,28.96 C29.1
N$48
  Top 0.508: R60.2 43.84,11.88 43.84,15.81 43.67,15.98 U2.4
N$51
  Top 0.254: U12.8 29.26,27.43
  Top 0.61: C29.2 25.7,28.02 26.3,27.42 27.83,27.42 27.86,27.39 28.61,27.39 U12.8
  Top 2: 29.26,27.43 28.75,27.93
  Top 2.54: L2.1 31,34.11 D20.2 29.73,34.41 28.75,33.43 28.75,27.93
N$52
  Top 0.61: U12.6 31.76,24.2 C37.2 33.57,24.18 C38.2
N$53
  Top 0.61: C37.1 31.89,26.09 R44.2
N$56
  Top 0.61: R64.2 72.39,8.21 Q6.1
N$58
  Top 0.61: R65.2 81.15,11.8 LED3.A
N$59
  Top 0.61: Q6.3 78.45,7.57 LED3.K
N$69
  Top 0.508: U17.6 11.31,30.27 C20.2
N$70
  Top 0.508: L1.1 11.29,35.56 C20.1 12.99,32.05 13.86,31.19 U17.5
N$75
  Top 1.016: D21.2 118.26,51.53 U8.VSYS
N$88
  Top 0.508: R85.2 34.57,64.33 34.88,64.03 IC1.18
N$90
  Top 0.305: 19.83,64.65 31.25,64.65 35.68,60.22
  Top 0.508: IC2.1 16.91,57.37 16.97,57.42 16.97,61.78 19.83,64.65 | IC1.21 35.68,60.22
N$91
  Top 0.305: 20.67,63.69 30.74,63.69 35.49,58.95
  Top 0.508: IC2.2 18.27,57.3 18.27,61.29 20.67,63.69 | IC1.22 35.49,58.95
N$92
  Top 0.305: 21.24,62.73 30.46,62.73 35.51,57.68
  Top 0.508: 21.24,62.73 19.54,61.03 19.54,57.37 19.52,57.36 IC2.3 | IC1.23 35.51,57.68
N$93
  Top 0.305: 35.44,56.41 30,61.85 22,61.85
  Top 0.508: IC2.4 20.8,60.64 22,61.85 | IC1.24 35.44,56.41
N$94
  Top 0.305: 22.96,60.95 29.69,60.95 35.49,55.14
  Top 0.508: IC1.25 35.49,55.14 | 22.96,60.95 22.07,60.05 IC2.5
N$95
  Top 0.305: 23.94,60.16 29.3,60.16 35.59,53.87
  Top 0.508: IC1.26 35.59,53.87 | 23.94,60.16 23.34,59.55 IC2.6
N$96
  Top 0.305: 24.99,59.36 28.74,59.36 35.5,52.6
  Top 0.508: IC1.27 35.5,52.6 | IC2.7 24.61,58.98 24.99,59.36
N$97
  Top 0.508: IC1.28 30.78,51.33 30.77,51.34 29.64,51.34 25.88,55.1 IC2.8
N$98
  Top 0.508: IC1.1 53.09,51.33 55.66,53.89 IC3.1
N$99
  Top 0.305: 56.93,58.63 56.34,59.22 54.96,59.22 54.24,58.5
  Top 0.508: IC1.2 52.16,52.6 54.24,54.68 54.24,58.5 | 56.93,58.63 IC3.2
N$100
  Top 0.305: 53.07,58.81 54.24,59.98 57.27,59.98 58.2,59.05
  Top 0.508: IC3.3 58.2,59.05 | IC1.3 51.12,53.87 53.07,55.82 53.07,58.81
N$101
  Top 0.305: 59.47,59.68 58.3,60.84 53.58,60.84 51.86,59.12
  Top 0.508: IC1.4 50.05,55.14 51.86,56.95 51.86,59.12 | 59.47,59.68 IC3.4
N$102
  Top 0.305: 51,57.71 51,60.12 52.72,61.84 59.09,61.84 60.74,60.19
  Top 0.508: IC1.5 49.7,56.41 51,57.71 | 60.74,60.19 IC3.5
N$103
  Top 0.305: 62.01,60.62 59.89,62.73 52.52,62.73 49.8,60.02 49.8,58.4
  Top 0.508: IC3.6 62.01,60.62 | IC1.6 49.08,57.68 49.8,58.4
N$104
  Top 0.305: 63.28,61.22 60.84,63.66 51.62,63.66 49.04,61.08 49.04,59.43 48.56,58.95
  Top 0.508: IC1.7 48.56,58.95 | 63.28,61.22 IC3.7
N$105
  Top 0.305: 61.48,64.58 51.32,64.58 48.18,61.44 48.18,60.5
  Top 0.508: IC3.8 64.56,61.5 61.48,64.58 | 48.18,60.5 47.9,60.22 IC1.8
RST
  Top 0.61: DISPLAY.5 92.97,39.04 R57.2
SAFETY_EN_DCDC
  Top 0.508: Q4.1 17.72,11.27 R27.1 18,11.5 R42.2
SCK
  Top 0.61: U8.GP18 80.16,34.78 82.97,31.96 R55.1
SCL  (via drill 0.35)
  Top 0.305: 46.35,10.73 43.61,7.99 39.49,7.99 | 60.35,42.3 60.35,18.42
  Top 0.508: 41.28,9.24 R58.1 | IC1.12 48.37,65.3 v48.38,65.32 | 38.37,6.88 35.43,6.88 34.71,7.6 U7.15
  Top 0.61: U8.GP5 105.56,62.19 | 105.56,62.19 105.56,58.55 99.86,52.84 76.87,52.84 v76.29,52.26 | 46.35,10.73 46.35,12.76 49.97,16.38 58.31,16.38 60.35,18.42 | v60.26,42.39 60.35,42.3 | 39.49,7.99 40.7,9.2 | 41.28,9.24 41.25,9.2 40.7,9.2 | 40.7,9.2 38.37,6.88 | R14.2 103.87,62.19 105.56,62.19
  Bottom 0.508: v48.38,65.32 48.53,65.32 63.09,50.76 63.09,50.65
  Bottom 0.61: v60.26,42.39 59.85,42.8 59.85,47.41 63.09,50.65 64.7,52.26 v76.29,52.26 | v76.29,52.26
SDA  (via drill 0.35)
  Top 0.305: v61.38,39.81 61.38,35.57 | 34.71,15.11 34.89,15.29 34.89,15.99 | 36.31,16.01 34.88,16.01
  Top 0.508: R60.1 40.98,11.33 39.39,12.92 37.53,14.79 | v48.76,66.59 48.74,66.57 IC1.13 | U7.2 34.71,15.11 | 34.89,15.99 34.88,16.01
  Top 0.61: 39.39,12.92 39.39,11.82 v39.33,11.75 | v79.33,51 100.93,51 108.1,58.17 108.1,61.97 | 108.1,61.97 U8.GP4 | v40.31,6.96 | v40.31,6.96 44.78,6.96 52.84,15.02 58.63,15.02 61.79,18.18 61.79,35.16 61.38,35.57 | R15.2 108.12,62 108.1,61.97 | 37.53,14.79 36.31,16.01
  Bottom 0.508: v79.33,51 79.33,51.08 77.06,53.36 61.99,53.36 v48.76,66.59
  Bottom 0.61: v39.33,11.75 40.31,10.77 v40.31,6.96 | v61.38,39.81 61.38,39.84 61.56,40.02 61.56,46.13 66.43,51 v79.33,51
SS
  Top 0.305: 99.54,31.06 82.05,31.06
  Top 0.61: U8.GP17 74.71,47.52 74.71,38.4 82.05,31.06 | R61.1 100.13,31.65 99.54,31.06
SW_GND  (via drill 0.35)
  Top 0.61: R40.2 50.13,48.45 51.73,50.04 55.43,50.04 59.69,54.3 v69.06,54.3 | v77.64,54.3 85.24,61.9 U8.GP11
  Bottom 0.61: v69.06,54.3 v77.64,54.3
SW_M1
  Top 0.61: IC2.20 15.21,66.74 7.14,74.81 7.14,94.3 6.67,94.78 K1.5
SW_M2
  Top 0.61: IC2.18 19.52,93.75 18.5,94.78 K4.5
SW_M3
  Top 0.61: IC2.16 22.07,69.98 24.75,72.67 31.35,72.67 32.74,74.07 32.74,93.76 31.73,94.78 K7.5
SW_M4
  Top 0.61: IC2.14 24.61,69.06 26.16,70.62 43.39,70.62 45.56,72.79 45.56,93.17 43.96,94.78 K10.5
SW_M5
  Top 0.508: IC3.20 55.66,69.44 58.28,72.07 58.28,92.93 56.44,94.78 K13.5
SW_M6
  Top 0.305: 58.2,69.05 62.73,73.57 70.14,73.57
  Top 0.508: IC3.18 58.2,69.05 | 70.14,73.57 70.96,74.4 70.96,92.6 68.79,94.78 K16.5
SW_M7
  Top 0.305: 60.74,68.94 63.66,71.86 82.01,71.86
  Top 0.508: IC3.16 60.74,68.94 | 82.01,71.86 83.2,73.06 83.2,93.31 81.73,94.78 K2.5
SW_M8
  Top 0.305: 93.37,70.13 64.41,70.13 63.28,69
  Top 0.508: IC3.14 63.28,69 | 93.37,70.13 95.95,72.71 95.95,93.76 94.93,94.78 K5.5
SW_M9
  Top 0.61: U8.GP3 110.64,67.81 110.96,68.13 110.96,69.47 R38.2
SW_M10
  Top 0.61: IC2.19 18.25,69.13 14.09,73.29 14.09,77.94 12.96,79.07 K11.5
SW_M11
  Top 0.61: IC2.17 20.8,70.73 26.39,76.33 26.39,78.34 25.66,79.07 K14.5
SW_M12
  Top 0.61: IC2.15 23.34,69.56 25.41,71.63 37.05,71.63 38.89,73.47 38.89,77.79 37.61,79.07 K17.5
SW_M13
  Top 0.61: IC2.13 25.88,68.51 26.67,69.31 48.64,69.31 51.66,72.33 51.66,77.86 50.45,79.07 K3.5
SW_M14
  Top 0.508: IC3.19 56.93,69.16 64.39,76.63 64.39,78.14 63.46,79.07 K6.5
SW_M15
  Top 0.305: 59.47,69.05 63.19,72.76 75.38,72.76
  Top 0.508: IC3.17 59.47,69.05 | 75.38,72.76 77.38,74.76 77.38,78.3 76.6,79.07 K9.5
  Top 0.61: K9.5
SW_M16
  Top 0.305: 87.84,70.96 64.07,70.96 62.01,68.9
  Top 0.508: IC3.15 62.01,68.9 | K12.5 88.31,79.07 89.75,77.63 89.75,72.87 87.84,70.96
SW_M17
  Top 0.305: 100.09,69.18 65.02,69.18 64.55,68.7
  Top 0.508: 100.09,69.18 102.6,71.69 102.6,77.98 101.51,79.07 K15.5 | IC3.13 64.55,68.7
SW_M18
  Top 0.61: U8.GP2 113.18,69.35 113.74,69.91 R2.2
TEST_1  (via drill 0.35)
  Top 0.508: R54.1 C13.2 102.45,21.31 v101.88,21.89
  Bottom 0.508: v101.88,21.89 100.72,23.05 100.72,39.26 97.7,42.28 87,42.28 85.24,44.04 U8.GP20
TEST_2  (via drill 0.35)
  Top 0.254: v112.02,44.44 111.91,44.55 111.91,49.29
  Top 0.508: R52.1 C12.2 105.17,31.12 104.41,31.87 104.41,43.05 105.8,44.44 v112.02,44.44
  Top 0.61: U8.GP1 118.26,63.66 112.28,57.68 112.28,49.66 111.91,49.29
TEST_3  (via drill 0.35)
  Top 0.254: v114.5,44.3 114.46,44.33 114.46,49.75
  Top 0.508: R48.1 105.6,36.88 C11.2 105.6,42.46 106.27,43.13 113.33,43.13 v114.5,44.3
  Top 0.61: 114.46,49.75 113.83,50.39 113.83,56.61 121.02,63.8 121.02,65.55 120.9,65.66 U8.GP0
TEST_4  (via drill 0.35)
  Top 0.61: R12.1 C22.2 103.34,13.46 103.34,19.91 v103.04,20.22 | v99.88,54.99 100.48,55.59 U8.GP6
  Bottom 0.305: v99.88,54.99 101.75,53.12 101.75,44.55 102.01,44.28
  Bottom 0.61: v103.04,20.22 103.8,20.97 103.8,42.5 102.01,44.28
V_MOT_SENSE  (via drill 0.35)
  Top 0.61: U5.3 58.76,44.07 59.21,44.51 59.21,46.15 58.87,46.48 RSENSE1.2
  Top 1.016: v57.87,48.63 RSENSE1.2
  Bottom 1.016: K18.6 112.97,76.57 114.35,77.95 114.35,83.14 112.74,84.76 96.66,84.76 94.86,82.96 | 94.86,82.96 82.41,82.96 | 82.41,82.96 69.72,82.96 | 69.72,82.96 56.66,82.96 | 56.66,82.96 44.26,82.96 | 44.26,82.96 31.67,82.96 | 31.67,82.96 18.34,82.96 | 18.34,82.96 9.89,82.96 7.03,85.82 | K8.6 102.99,92.23 102.43,92.8 102.43,96.62 100.49,98.56 89.71,98.56 | 89.71,98.56 77.09,98.56 | 77.09,98.56 64.7,98.56 | 64.7,98.56 51.38,98.56 | 51.38,98.56 39.26,98.56 | 39.26,98.56 26.17,98.56 | 26.17,98.56 13.71,98.56 | 13.71,98.56 8.89,98.56 7.03,96.7 7.03,85.82 | K1.6 4.75,88.09 7.03,85.82 | K4.6 14.9,92.23 13.71,93.43 13.71,98.56 | K7.6 27.48,92.23 26.17,93.55 26.17,98.56 | K10.6 40.34,92.23 39.22,93.35 39.22,98.52 39.26,98.56 | K13.6 52.38,92.23 51.38,93.23 51.38,98.56 | K16.6 65.62,92.23 64.62,93.23 64.62,98.48 64.7,98.56 | K2.6 78.01,92.23 77.09,93.16 77.09,98.56 | K5.6 91.21,92.23 89.71,93.74 89.71,98.56 | 7.03,85.82 7.03,78.4 8.89,76.53 K11.6 10.79,75.97 10.79,54.58 13.36,52.01 54.5,52.01 v57.87,48.63 | K15.6 96.94,76.53 96.21,77.26 96.21,81.62 94.86,82.96 | K12.6 84.87,76.53 83.34,78.06 83.34,82.03 82.41,82.96 | K9.6 71.84,76.53 70.94,77.44 70.94,81.74 69.72,82.96 | K6.6 58.97,76.53 58.27,77.23 58.27,81.36 56.66,82.96 | K3.6 46.15,76.53 45.53,77.16 45.53,81.69 44.26,82.96 | K17.6 33.57,76.53 32.79,77.31 32.79,81.85 31.67,82.96 | K14.6 20.28,76.53 19.5,77.31 19.5,81.8 18.34,82.96
VBUS  (via drill 0.35)
  Top 0.61: C19.2 33.81,22.23 R11.2 34.85,22.29 37.17,24.61 L2.2
  Bottom 0.61: D15.2 71.62,111.15 71.62,112.45
  Bottom 1.016: D1.2 14.73,113.25 14.73,112.45 | 2.39,81.4 2.39,78.27 5.2,75.47
  Bottom 1.27: J10.2 13.5,111.22 14.73,112.45 | 14.73,112.45 16.6,112.45 | 16.6,112.45 20.88,112.45 | 20.88,112.45 22.57,112.45 | 22.57,112.45 27.5,112.45 | 27.5,112.45 28.87,112.45 | 28.87,112.45 33.5,112.45 | 33.5,112.45 35.27,112.45 | 35.27,112.45 40.38,112.45 | 40.38,112.45 42.17,112.45 | 42.17,112.45 46.34,112.45 | 46.34,112.45 48.02,112.45 | 48.02,112.45 53.18,112.45 | 53.18,112.45 54.72,112.45 | 54.72,112.45 59.23,112.45 | 59.23,112.45 65.94,112.45 | 65.94,112.45 67.37,112.45 | 67.37,112.45 71.62,112.45 73.87,112.45 | 73.87,112.45 78.71,112.45 | 78.71,112.45 80.07,112.45 | 80.07,112.45 84.79,112.45 | 84.79,112.45 86.04,112.45 | 86.04,112.45 91.36,112.45 | 91.36,112.45 92.76,112.45 | 92.76,112.45 97.19,112.45 | 97.19,112.45 98.73,112.45 | 98.73,112.45 104.04,112.45 | 104.04,112.45 105.45,112.45 | 105.45,112.45 109.71,112.45 | 109.71,112.45 111.33,112.45 | J18.2 114.76,109.03 111.33,112.45 | J9.2 105.45,112.45 | J17.2 98.73,112.45 | J8.2 92.76,112.45 | J16.2 86.04,112.45 | J7.2 80.07,112.45 | J15.2 73.87,111.93 73.87,112.45 | J6.2 67.37,112.45 | J14.2 60.65,112.45 60.66,112.45 59.35,111.15 D14.2 59.22,112.44 59.23,112.45 | J5.2 54.72,112.49 54.72,112.45 | J4.2 42.17,112.64 42.17,112.45 | J12.2 35.27,112.45 | J3.2 32.41,116 28.87,112.45 | J11.2 22.57,112.45 | J2.2 16.6,112.45 | 9.77,112.45 9.23,112.45 7.45,114.23 J1.2 | 9.77,112.45 14.73,112.45 | v47.62,27.37 47.62,40.12 39.01,48.73 13.49,48.73 8.74,53.47 8.74,71.92 5.2,75.47 J22.1 | 9.77,112.45 6.28,108.96 6.28,106.41 D10.2 6.3,106.39 4.12,106.39 2.39,104.66 2.39,81.4 | D11.2 20.99,112.34 20.88,112.45 | D2.2 27.61,112.56 27.5,112.45 | D12.2 33.5,111.57 33.5,112.45 | D9.2 109.71,111.38 109.71,112.45
  Bottom 1.27: 111.33,112.45 118.8,112.45 119.64,111.61 119.64,101.44 D18.2 119.56,101.36 D19.2 | D17.2 97.22,112.43 97.19,112.45 | D8.2 104.04,113.44 104.04,112.45 | D7.2 91.36,113.34 91.36,112.45 | D6.2 78.71,113.55 78.71,112.45 | D5.2 65.94,113.24 65.94,112.45 | D4.2 53.18,113.13 53.18,112.45 | D3.2 40.38,113.23 40.38,112.45 | D16.2 84.79,112.45 | D13.2 46.38,112.42 46.34,112.45 | J13.2 51.58,108.9 48.02,112.45 | D19.2
  other vias: 44.24,25.81 50.1,25.59 50.66,26.03 49.53,26.22 49.15,25.4 48.24,25.3 47.13,25.4 46.81,26.43 47.83,26.3 48.6,26.38 46.53,27.39 48.68,27.37 49.7,27.37 50.54,27.34 44.48,26.96 43.46,26.96 43.46,24.89 44.45,24.92 54.85,25.34 54.07,25.87 52.94,26.06 52.54,25.3 51.64,25.14 51.23,26.61 52,26.22 52.08,27.21 53.11,27.21 53.95,27.18 58.88,24.77 58.63,25.96 57.44,26.21 56.7,25.64 55.77,25.17 55.36,26.17 56.13,26.25 56.21,27.25 57.24,27.25 58.07,27.21
  pour Top: 37.75,27.61 59.39,27.61 59.39,22.52 59,22.13 37.75,22.13
  pour Bottom: 37.83,27.82 59.39,27.82 59.39,22.52 59,22.13 37.83,22.13
VCC  (via drill 0.35)  (1 unrouted)
  Top 0.305: K6.2 67.1,78.07 67.12,78.05 | K14.2 29.1,78.54
  Top 0.508: IC2.12 27.14,68.25 27.12,68.28 | IC3.12 65.82,64.93
  Top 0.61: C9.1 45.94,38.87 U6.5 | C10.1 52.19,43.99 54.02,42.16 U5.5 | DISPLAY.2 85.31,35.98 C14.1 | v41.14,13.09 40.83,13.09 39.83,14.09 C60.2
  Top 1.016: K1.2 9.84,96.29 9.65,96.47 9.65,94.96 K1.2 | K1.2 9.88,94.82 11.35,94.82 | K1.2 8.49,94.78 8.43,94.83 | K1.2 9.8,94.74 9.8,93.9 | K4.2 21.26,94.78 21.16,94.87 | K4.2 22.49,93.92 | K4.2 23.6,94.78 23.61,94.78 | K4.2 22.49,96.08 22.46,96.11 | K7.2 35.1,94.82 33.88,94.82 | K7.2 35.15,95.78 35.19,95.82 | K7.2 36.32,94.78 36.34,94.76 | K7.2 35.15,93.94 | K10.2 46.59,94.78 | K10.2 47.8,95.65 47.86,95.72 | K10.2 48.77,94.78 48.8,94.75 | K10.2 47.8,94.03 47.77,94.01 | K13.2 60.46,93.84 60.49,93.81 | K13.2 59.29,94.78 59.28,94.78 | K13.2 60.46,95.67 60.51,95.72 | K13.2 61.6,94.78 | K16.2 73.14,94.74 73.14,93.84 | K16.2 73.07,94.81 73.07,95.72 | K16.2 74.31,94.78 74.37,94.83 | K16.2 71.96,94.78 71.91,94.83 | K2.2 85.82,94.72 85.82,93.92 | K2.2 84.57,94.78 84.55,94.8 | K2.2 85.77,95.78 85.81,95.82 | K2.2 86.77,94.78 86.85,94.85 | K5.2 98.42,94.14 98.41,94.13 | K5.2 97.34,94.78 97.33,94.78 | K5.2 98.42,95.56 98.39,95.59 | K5.2 99.63,94.78 | K8.2 111.08,93.89 111.1,93.86 | K8.2 111.06,94.76 109.95,94.76 | K8.2 111.08,95.85 111.09,95.86 | K8.2 112.01,94.78 112.04,94.75 | K18.2 117.76,80.25 117.88,80.37 | K18.2 118.94,79.11 118.95,79.1 | K18.2 117.77,79.11 117.77,78.23 | K18.2 117.01,79.11 116.98,79.14 | K15.2 104.05,79.07 103.99,79.01 | K15.2 105.1,79.83 105.14,79.87 | K15.2 105.12,79.1 106.08,79.1 | K15.2 105.1,78.15 105.11,78.14 | K12.2 92.43,80.07 92.49,80.13 | K12.2 93.7,79.07 93.8,78.97 | K12.2 92.44,78.23 | K12.2 92.37,79.01 91.22,79.01 | K9.2 79.77,79.94 | K9.2 80.97,79.07 80.97,79.06 | K9.2 79.77,78.28 79.83,78.21 | K9.2 78.97,79.07 78.96,79.08 | K6.2 67.08,79.09 67.08,80.14 | K6.2 68.11,79.07 68.19,78.99 | K6.2 66.16,79.07 66.11,79.02 | K3.2 54.43,78.23 54.48,78.18
  Top 1.016: K3.2 54.57,78.93 55.55,78.93 | K3.2 54.43,80.07 54.39,80.11 | K3.2 54.38,79.13 52.98,79.13 | K17.2 41.77,78.14 41.79,78.12 | K17.2 41.81,79.11 42.82,79.11 | K17.2 41.77,80.08 41.8,80.11 | K17.2 40.51,79.07 40.49,79.05 | 29.1,78.54 29.12,78.52 | K14.2 30.02,79.07 30.07,79.02 | K14.2 29.08,79.09 29.08,80.01 | K14.2 29.03,79.14 28.05,79.14 | K11.2 16.45,79.05 16.45,78.2 | K11.2 17.47,79.07 17.49,79.05 | K11.2 16.43,79.96 | K11.2 16.42,79.05 15.54,79.05
  Bottom 0.508: K8.2 111.08,97.94 D23.2 | D22.2 105.82,81.58 105.01,80.76 105.01,79.16 K15.2
  Bottom 0.61: v41.14,13.09 48.85,13.09 v49.13,13.36
  pour Top (isolate 0.305, rank 3): -5.33,122.88 125.9,122.88 125.9,-2.49 -5.33,-2.49
VIN
  Top 0.508: R41.2 12.41,13.87 2.34,13.87 1.03,15.18 1.03,25.45 1.25,25.67 J19.1
  Top 1.27: U12.2 19.54,25.47 C17.1
  pour Top: 1.79,24.61 1.79,27.59 22.16,27.59 22.16,27.54 22.16,24.61
VMOT1-
  Top 1.27: J1.1 9.99,112.75 7.33,110.09 7.33,102.39 K1.3 K1.4
  Bottom 1.016: D1.1 11.49,117.5 J1.1
VMOT2-
  Top 1.27: K4.4 19.76,102.39 | 19.76,102.39 K4.3 | J2.1 22.68,112.89 19.76,109.97 19.76,102.39
  Bottom 1.27: D2.1 23.98,117.3 J2.1
VMOT3-
  Top 1.27: J3.1 35.37,111.52 32.71,108.86 32.71,102.59 32.91,102.39 K7.3 K7.4
  Bottom 1.27: D3.1 36.72,117.34 J3.1
VMOT4-
  Top 1.27: K10.4 45.65,102.39 | 45.65,102.39 K10.3 | 45.65,102.39 45.65,109.61 48.07,112.03 J4.1
  Bottom 1.27: J4.1 49.48,117.4 D4.1
VMOT5-
  Top 1.27: K13.4 57.85,102.39 | 57.85,102.39 K13.3 | 57.85,102.39 58.33,102.87 58.33,109.19 60.76,111.62 J5.1
  Bottom 1.27: J5.1 62.3,117.53 D5.1
VMOT6-
  Top 1.27: K16.4 70.65,102.39 | 70.65,102.39 K16.3 | 70.65,102.39 71.07,102.81 71.07,109.19 73.45,111.58 J6.1
  Bottom 1.27: J6.1 75.29,117.83 D6.1
VMOT7-
  Top 1.27: K2.4 83.39,102.39 | 83.39,102.39 K2.3 | 83.39,102.39 83.39,108.66 86.15,111.42 J7.1
  Bottom 1.27: J7.1 87.74,117.59 D7.1
VMOT8-
  Top 1.27: K5.4 95.77,102.39 | 95.77,102.39 K5.3 | 95.77,102.39 96.36,102.99 96.36,109.14 98.84,111.62 J8.1
  Bottom 1.27: J8.1 100.56,117.72 D8.1
VMOT9-
  Top 1.27: K8.4 108.44,102.39 | 108.44,102.39 K8.3 | 108.44,102.39 108.74,102.69 108.74,108.84 111.53,111.63 J9.1
  Bottom 1.27: D9.1 111.08,105.63 K8.3
VMOT10-
  Top 1.27: J10.1 16.04,107.97 13.87,105.8 13.87,86.81 13.75,86.69 | K11.4 13.75,86.69 | 13.75,86.69 K11.3
  Bottom 1.27: D10.1 10.42,106.39 14.74,106.39 16.04,107.68 J10.1
VMOT11-
  Top 1.27: K14.3 26.36,86.69 | 26.36,86.69 K14.4 | 26.36,86.69 26.36,103.04 28.73,105.41 J11.1
  Bottom 1.27: D11.1 23.07,107.37 24.1,106.34 27.57,106.34 28.73,107.5 J11.1
VMOT12-
  Top 1.27: K17.3 39.28,86.69 | 39.28,86.69 K17.4 | 39.28,86.69 39.28,104.11 41.42,106.25 J12.1
  Bottom 1.27: D12.1 36.45,107.33 37.17,106.61 40.79,106.61 41.46,107.28 41.46,108.8 J12.1
VMOT13-
  Top 1.27: K3.3 51.78,86.69 | 51.78,86.69 K3.4 | 51.78,86.69 51.78,103.9 54.12,106.23 J13.1
  Bottom 1.27: D13.1 46.67,105.9 53.38,105.9 54.12,106.64 J13.1
VMOT14-
  Top 1.27: K6.4 64.5,86.69 | 64.5,86.69 K6.3 | 64.5,86.69 64.5,104.25 66.81,106.57 J14.1
  Bottom 1.27: D14.1 61.03,107.06 62.46,105.63 65.29,105.63 66.81,107.15 J14.1
VMOT15-
  Top 1.27: K9.3 77,86.69 | 77,86.69 K9.4 | 77,86.69 77,104.11 79.5,106.62 J15.1
  Bottom 1.27: D15.1 73.4,106.91 74.57,105.74 78.63,105.74 79.5,106.62 J15.1
VMOT16-
  Top 1.27: K12.3 89.78,86.69 | 89.78,86.69 K12.4 | 89.78,86.69 89.78,103.25 92.2,105.67 J16.1
  Bottom 1.27: D16.1 86.76,107.05 88.26,105.55 90.66,105.55 92.2,107.09 J16.1
VMOT17-
  Top 1.27: J17.1 104.89,106.22 102.42,103.75 102.42,86.75 | 102.42,86.75 102.48,86.69 K15.3 | K15.4 100.07,86.75 102.42,86.75
  Bottom 1.27: D17.1 99,105.36 103.69,105.36 104.89,106.55 J17.1
VMOT18-
  Top 1.27: K18.3 115.35,86.73 | 115.35,86.73 K18.4 | 115.35,86.73 115.35,98.18 117.42,100.25 117.42,108.32 J18.1
  Bottom 1.27: D18.1 115.5,104.86 116.91,106.27 J18.1

## Text on the board
tPlace: + | - | + | - | + | - | + | - | + | - | + | - | + | - | + | - | + | - | + | - | + | - | + | - | + | - | + | - | + | - | + | - | + | - | + | - | VBUS | GND | IMOTOR | GND | IFREC | GND | GND | + | - | GND | TestMachine / v1-Mar'25